# Altium schematic sheet Sheet1.SchDoc
size A; SheetNumber: 1; SheetTotal: 1; SPICEModelCacheGBNJOVXN: <root> / <DocumentId>GBNJOVXN</DocumentId> / <CacheFrame Number="0"> / <Model Name="2n3906" Kind="MDL"> / <Text>*2N3906 / *Si 310mW  40V 200mA 250MHz pkg:TO-92B 1,2,3 / .MODEL 2N3906 PNP(IS=4E-14 BF=400 VAF=50 IKF=0.02 ISE=7E-15 NE=1.16 / + BR=7.5 RC=2.4 CJE=6.3E-12 VJE=0.75 TF=5E-10 CJC=5.8E-12 VJC=0.75 TR=2.3E-8 / + VJS=0.75 XTB=1.5 KF=6E-16 )</Text> / </Model> / </CacheFrame> / </root>
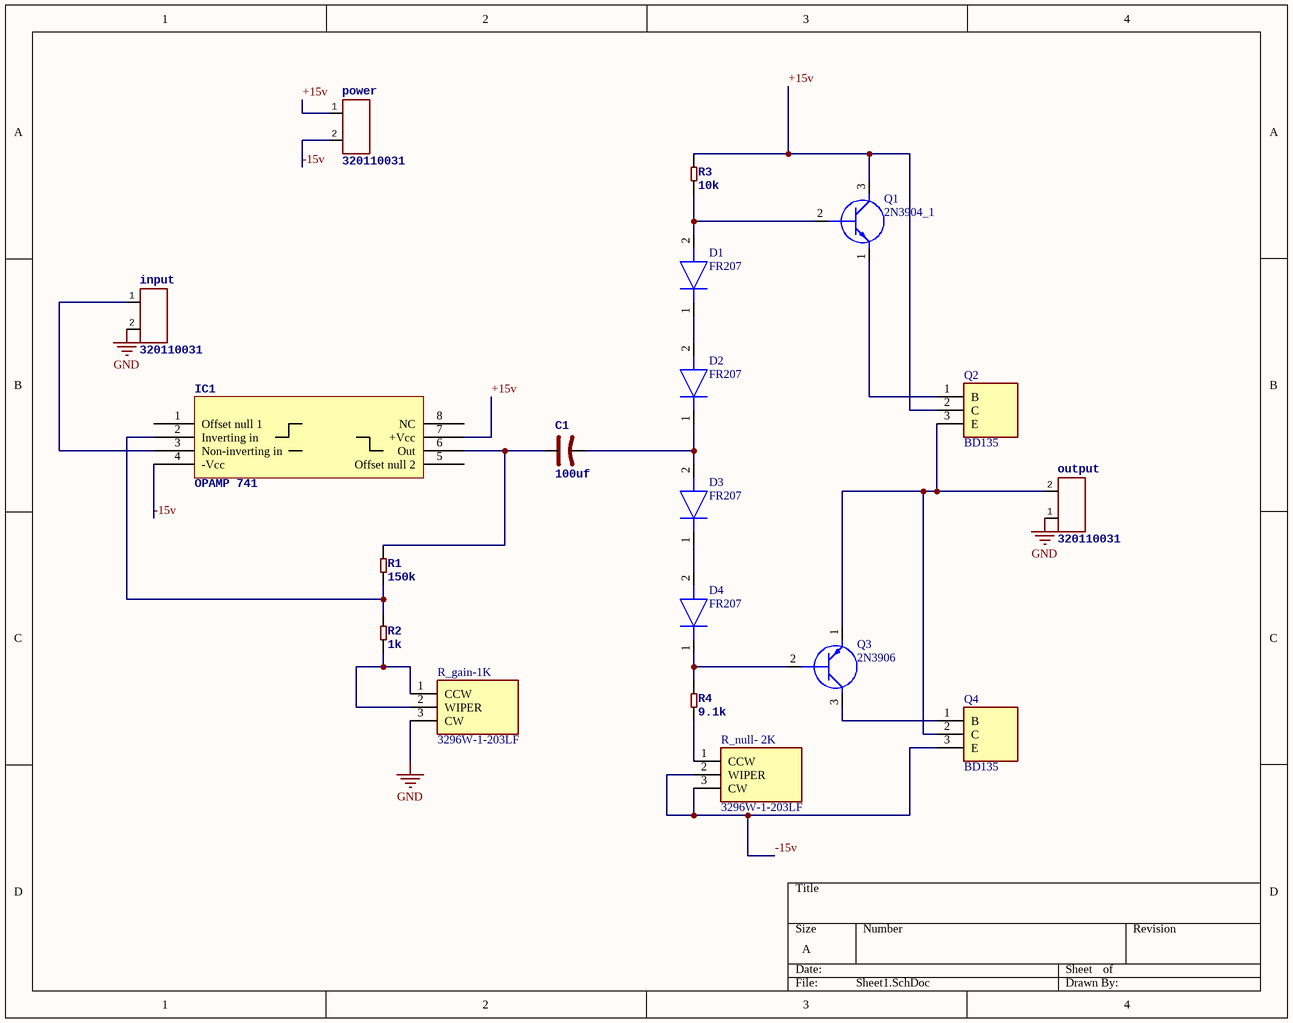
[diagram p0: Sheet1.SchDoc]

## Parts
C1  100uf  [CAP TH]
D1  FR207  [DIOAD1910W90L670D310]
D2  FR207  [DIOAD1910W90L670D310]
D3  FR207  [DIOAD1910W90L670D310]
D4  FR207  [DIOAD1910W90L670D310]
IC1  OPAMP 741  [DIL08-ROUND]
input  320110031  [H2-5.0-10.5X8.0MM]
output  320110031  [H2-5.0-10.5X8.0MM]
power  320110031  [H2-5.0-10.5X8.0MM]
Q1  2N3904_1  [LM431ACZ]
Q2  BD135  [TO254P290X760X1320-3P]
Q3  2N3906  [2N5457]
Q4  BD135  [TO254P290X760X1320-3P]
R1  150k  [Res 1/4w]
R2  1k  [Res 1/4w]
R3  10k  [Res 1/4w]
R4  9.1k  [Res 1/4w]
R_gain-1K  3296W-1-203LF  [3296W-1]
R_null-_2K  3296W-1-203LF  [3296W-1]

## Nets
GND: input.2 output.1 R_gain-1K.3(CW)
+15v: IC1.7(+Vcc) power.1 Q1.3(C) Q2.2(C) R3.2
-15v: IC1.4(-Vcc) power.2 Q4.3(E) R_null-_2K.2(WIPER) R_null-_2K.3(CW)
NetC1_1: C1.1(+) IC1.6(Out) R1.2
NetC1_2: C1.2(-) D2.1(K) D3.2(A)
NetD1_1: D1.1(K) D2.2(A)
NetD1_2: D1.2(A) Q1.2(B) R3.1
NetD3_1: D3.1(K) D4.2(A)
NetD4_1: D4.1(K) Q3.2(B) R4.2
NetIC1_2: IC1.2(Inverting_in) R1.1 R2.2
NetIC1_3: IC1.3(Non-inverting_in) input.1
Netoutput_2: output.2 Q2.3(E) Q3.1(E) Q4.2(C)
NetQ1_1: Q1.1(E) Q2.1(B)
NetQ3_3: Q3.3(C) Q4.1(B)
NetR2_1: R2.1 R_gain-1K.1(CCW) R_gain-1K.2(WIPER)
NetR4_1: R4.1 R_null-_2K.1(CCW)

Not connected (* = marked no-connect by the designer): IC1 1(Offset_null_1) 5(Offset_null_2) 8(NC)

## Library data of the parts
C1 = CAP THT
D1-D4 = FR207: Diode; Manufacturer_Name: Rectron; Datasheet Link: https://www.arrow.com/en/products/fr207/rectron; Manufacturer_Part_Number: FR207; Arrow Part Number: FR207; Arrow Price/Stock: https://www.arrow.com/en/products/fr207/rectron?region=nac
input output power = SCREW-TERMINAL-GREEN(2P-5.0)
Q1 = 2N3904_1: Transistor BJT NPN; Manufacturer_Name: onsemi; Manufacturer_Part_Number: 2N3904BU; Datasheet Link: http://www.onsemi.com/pub/Collateral/2N3904-D.pdf; Height: 5.33mm; Mouser Part Number: 512-2N3904BU; Mouser Price/Stock: https://www.mouser.co.uk/ProductDetail/onsemi-Fairchild/2N3904BU?qs=or4AE2qAS%252Bd0Jdpn%2F8ktKg%3D%3D; Arrow Part Number: 2N3904BU; Arrow Price/Stock: https://www.arrow.com/en/products/2n3904bu/on-semiconductor?region=europe
Q2 Q4 = BD135: Integrated Circuit; Manufacturer_Name: STMicroelectronics; Datasheet Link: http://www.st.com/web/en/resource/technical/document/datasheet/CD00001225.pdf; Height: 2.9mm; Manufacturer_Part_Number: BD135; Mouser Part Number: 511-BD135; Mouser Price/Stock: https://www.mouser.co.uk/ProductDetail/STMicroelectronics/BD135?qs=DcAdhm6iCnquzRqyLiHtjA%3D%3D; Arrow Part Number: BD135; Arrow Price/Stock: https://www.arrow.com/en/products/bd135/stmicroelectronics?region=nac
Q3 = 2N3906: Transistor BJT PNP; Manufacturer_Name: Central Semiconductor; Datasheet Link: http://www.mouser.com/datasheet/2/68/2n3905-29545.pdf; Height: 5.33mm; Manufacturer_Part_Number: 2N3906; Mouser Part Number: 610-2N3906; Mouser Price/Stock: https://www.mouser.com/Search/Refine.aspx?Keyword=610-2N3906
R1-R4 = RES_THT
R_gain-1K R_null-_2K = 3296W-1-203LF: Resistor; Manufacturer_Name: Bourns; Datasheet Link: http://www.bourns.com/docs/Product-Datasheets/3296.pdf; Manufacturer_Part_Number: 3296W-1-203LF; Mouser Part Number: 652-3296W-1-203LF; Mouser Price/Stock: https://www.mouser.co.uk/ProductDetail/Bourns/3296W-1-203LF?qs=UBppDQZA%252BGQoINFzp6sGqA%3D%3D; Arrow Part Number: 3296W-1-203LF; Arrow Price/Stock: https://www.arrow.com/en/products/3296w-1-203lf/bourns?region=europe